# Altium schematic sheet nguyenly_so.SchDoc
size A3; SheetNumber: 1; SheetTotal: 1
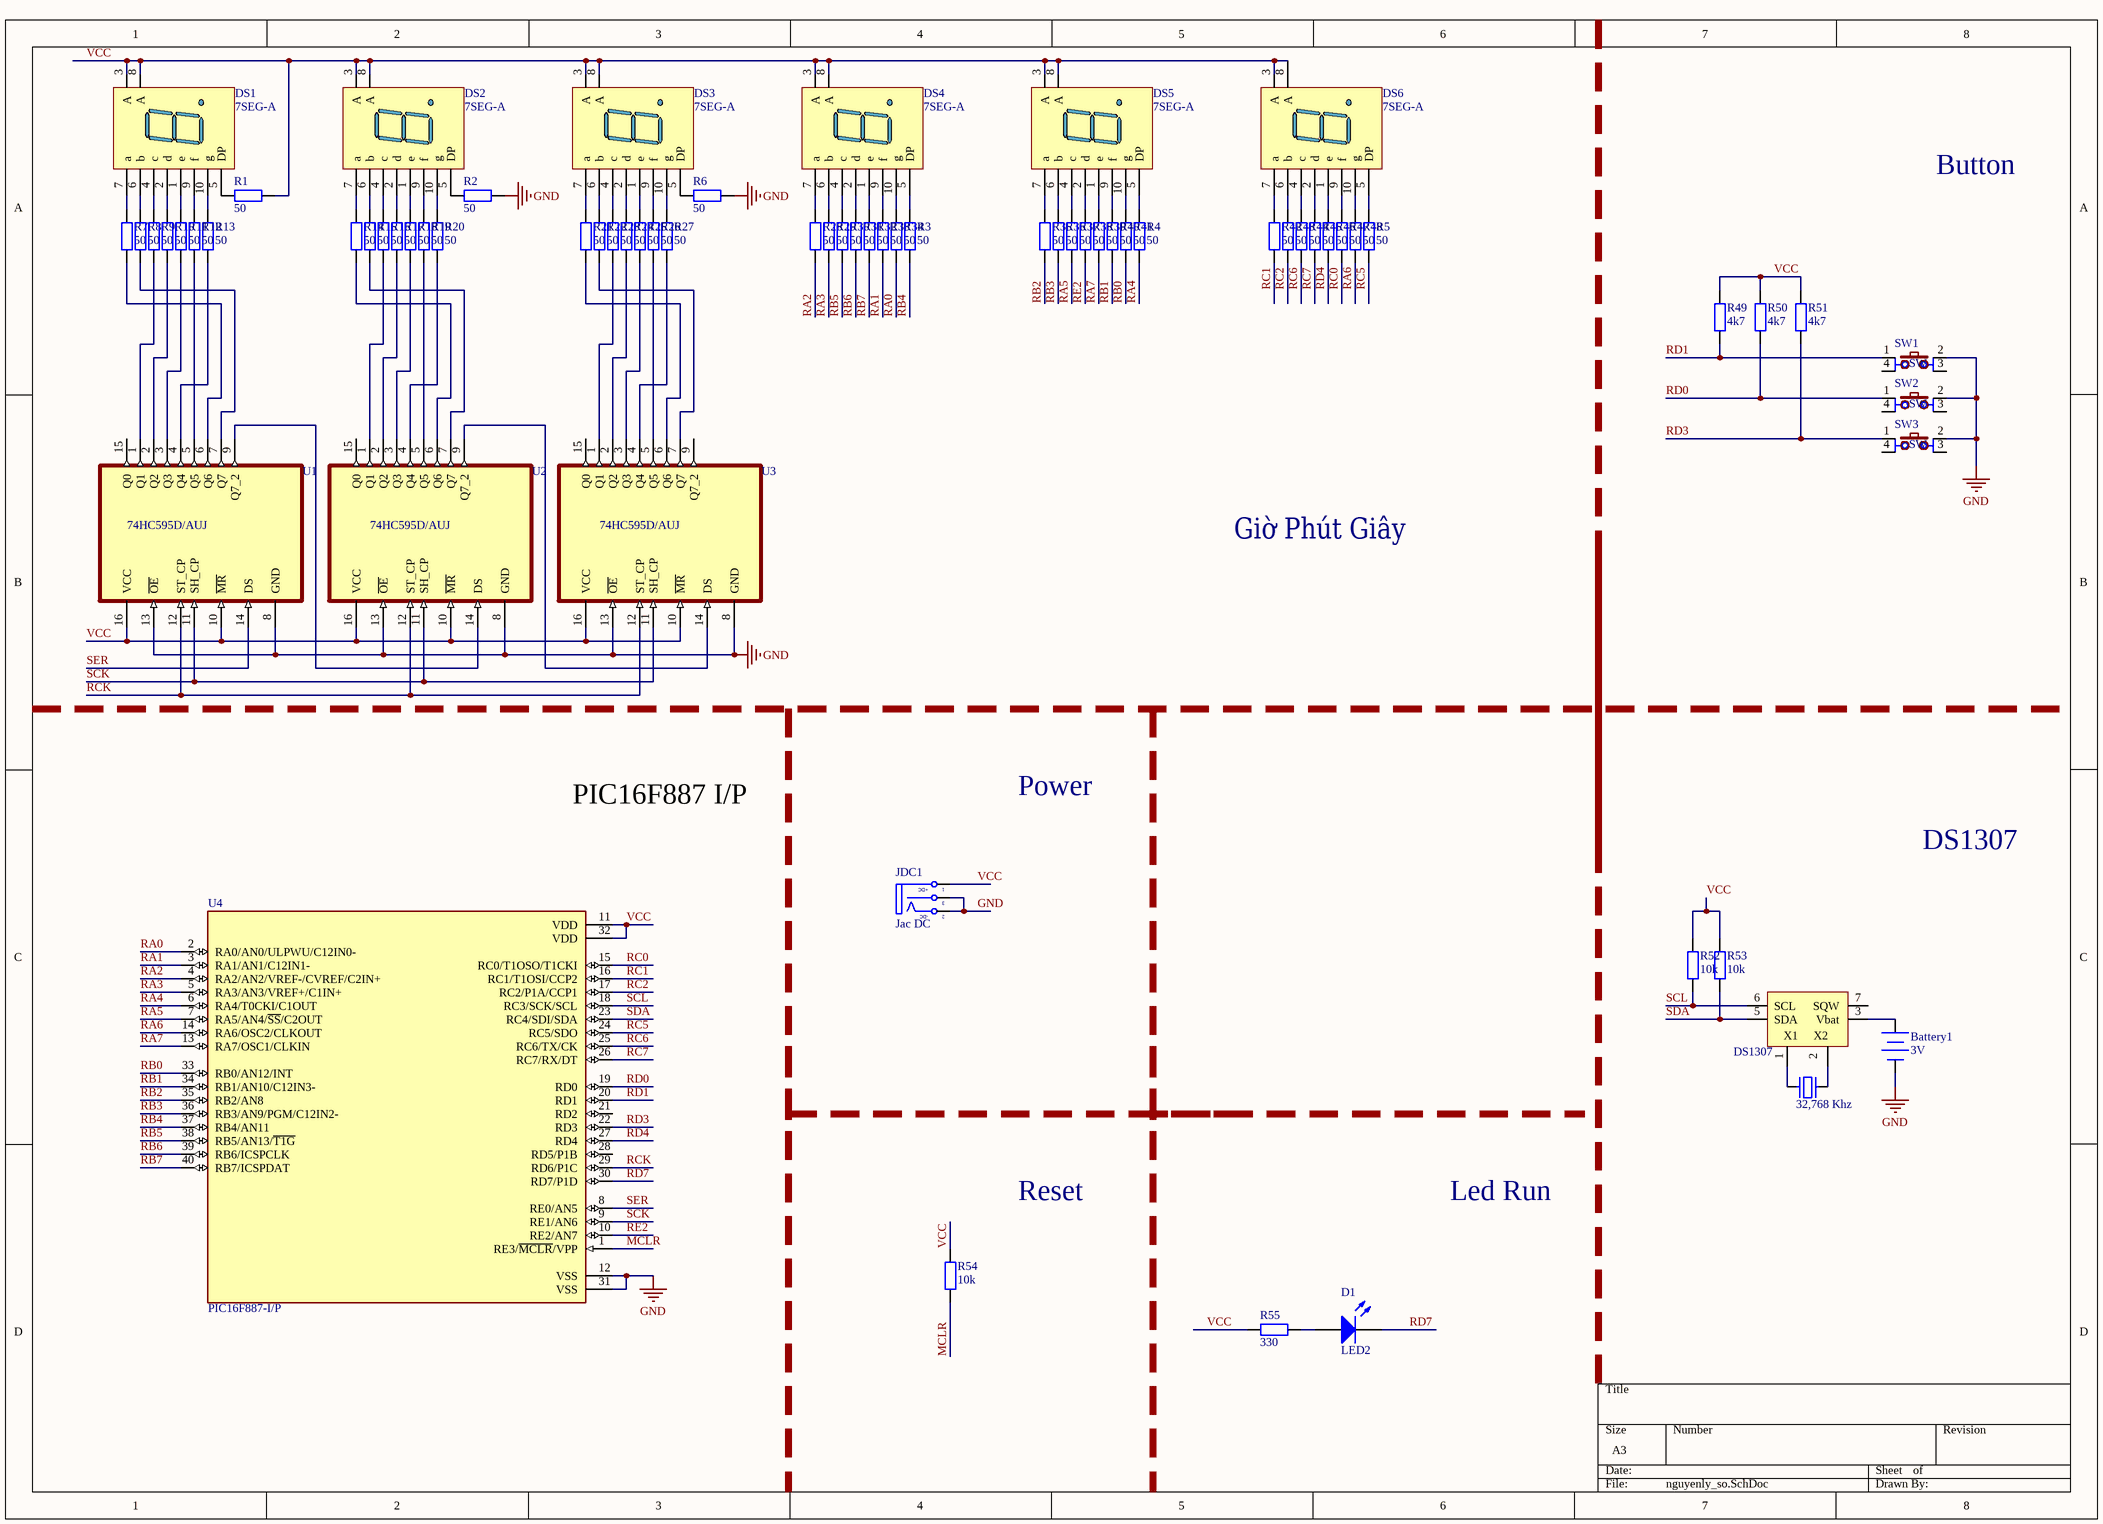
[diagram p0: nguyenly_so.SchDoc]

## Parts
Battery1  3V  [PIN_3v]
D1  LED2  [3.2X1.6X1.1]
DS1  7SEG-A  [led 7seg 3x4cm anot]
DS2  7SEG-A  [led 7seg 3x4cm anot]
DS3  7SEG-A  [led 7seg 3x4cm anot]
DS4  7SEG-A  [led 7seg 3x4cm anot]
DS5  7SEG-A  [led 7seg 3x4cm anot]
DS6  7SEG-A  [led 7seg 3x4cm anot]
IC1  DS1307  [DIP8/W0.3]
JDC1  Jac DC  [DC-IN]
R1  50  [SM-RES-0805]
R2  50  [SM-RES-0805]
R3  50  [SM-RES-0805]
R4  50  [SM-RES-0805]
R5  50  [SM-RES-0805]
R6  50  [SM-RES-0805]
R7  50  [SM-RES-0805]
R8  50  [SM-RES-0805]
R9  50  [SM-RES-0805]
R10  50  [SM-RES-0805]
R11  50  [SM-RES-0805]
R12  50  [SM-RES-0805]
R13  50  [SM-RES-0805]
R14  50  [SM-RES-0805]
R15  50  [SM-RES-0805]
R16  50  [SM-RES-0805]
R17  50  [SM-RES-0805]
R18  50  [SM-RES-0805]
R19  50  [SM-RES-0805]
R20  50  [SM-RES-0805]
R21  50  [SM-RES-0805]
R22  50  [SM-RES-0805]
R23  50  [SM-RES-0805]
R24  50  [SM-RES-0805]
R25  50  [SM-RES-0805]
R26  50  [SM-RES-0805]
R27  50  [SM-RES-0805]
R28  50  [SM-RES-0805]
R29  50  [SM-RES-0805]
R30  50  [SM-RES-0805]
R31  50  [SM-RES-0805]
R32  50  [SM-RES-0805]
R33  50  [SM-RES-0805]
R34  50  [SM-RES-0805]
R35  50  [SM-RES-0805]
R36  50  [SM-RES-0805]
R37  50  [SM-RES-0805]
R38  50  [SM-RES-0805]
R39  50  [SM-RES-0805]
R40  50  [SM-RES-0805]
R41  50  [SM-RES-0805]
R42  50  [SM-RES-0805]
R43  50  [SM-RES-0805]
R44  50  [SM-RES-0805]
R45  50  [SM-RES-0805]
R46  50  [SM-RES-0805]
R47  50  [SM-RES-0805]
R48  50  [SM-RES-0805]
R49  4k7  [SM-RES-0805]
R50  4k7  [SM-RES-0805]
R51  4k7  [SM-RES-0805]
R52  10k  [SM-RES-0805]
R53  10k  [SM-RES-0805]
R54  10k  [SM-RES-0805]
R55  330  [SM-RES-0805]
SW1  SW  [SW2-DIP]
SW2  SW  [SW2-DIP]
SW3  SW  [SW2-DIP]
U1  74HC595D/AUJ  [SOIC127P600X175-16N]
U2  74HC595D/AUJ  [SOIC127P600X175-16N]
U3  74HC595D/AUJ  [SOIC127P600X175-16N]
U4  PIC16F887-I/P  [DIP1543W47P254L5175H635Q40]
X1  32,768 Khz  [XT32k]

## Nets
GND: Battery1.2(-) IC1.4(GND) JDC1.2(TN) JDC1.3(S) R2.1 R6.2 SW1.2 SW2.2 SW3.2 U1.8(GND) U1.13(~{OE}) U2.8(GND) U2.13(~{OE}) U3.8(GND) U3.13(~{OE}) U4.12(VSS) U4.31(VSS)
VCC: DS1.3(A) DS1.8(A) DS2.3(A) DS2.8(A) DS3.3(A) DS3.8(A) DS4.3(A) DS4.8(A) DS5.3(A) DS5.8(A) DS6.3(A) DS6.8(A) IC1.8(VCC) JDC1.1(T) R1.1 R49.1 R50.1 R51.1 R52.1 R53.1 R54.1 R55.1 U1.10(~{MR}) U1.16(VCC) U2.10(~{MR}) U2.16(VCC) U3.10(~{MR}) U3.16(VCC) U4.11(VDD) U4.32(VDD)
MCLR: R54.2 U4.1(RE3/~{MCLR}/VPP)
RA0: R34.1 U4.2(RA0/AN0/ULPWU/C12IN0-)
RA1: R33.1 U4.3(RA1/AN1/C12IN1-)
RA2: R28.1 U4.4(RA2/AN2/VREF-/CVREF/C2IN+)
RA3: R29.1 U4.5(RA3/AN3/VREF+/C1IN+)
RA4: R4.1 U4.6(RA4/T0CKI/C1OUT)
RA5: R37.1 U4.7(RA5/AN4/~{SS}/C2OUT)
RA6: R48.1 U4.14(RA6/OSC2/CLKOUT)
RA7: R39.1 U4.13(RA7/OSC1/CLKIN)
RB0: R41.1 U4.33(RB0/AN12/INT)
RB1: R40.1 U4.34(RB1/AN10/C12IN3-)
RB2: R35.1 U4.35(RB2/AN8)
RB3: R36.1 U4.36(RB3/AN9/PGM/C12IN2-)
RB4: R3.1 U4.37(RB4/AN11)
RB5: R30.1 U4.38(RB5/AN13/~{T1G})
RB6: R31.1 U4.39(RB6/ICSPCLK)
RB7: R32.1 U4.40(RB7/ICSPDAT)
RC0: R47.1 U4.15(RC0/T1OSO/T1CKI)
RC1: R42.1 U4.16(RC1/T1OSI/CCP2)
RC2: R43.1 U4.17(RC2/P1A/CCP1)
RC5: R5.1 U4.24(RC5/SDO)
RC6: R44.1 U4.25(RC6/TX/CK)
RC7: R45.1 U4.26(RC7/RX/DT)
RCK: U1.12(ST_CP) U2.12(ST_CP) U3.12(ST_CP) U4.29(RD6/P1C)
RD0: R50.2 SW2.1 U4.19(RD0)
RD1: R49.2 SW1.1 U4.20(RD1)
RD3: R51.2 SW3.1 U4.22(RD3)
RD4: R46.1 U4.27(RD4)
RD7: D1.2(K) U4.30(RD7/P1D)
RE2: R38.1 U4.10(RE2/AN7)
SCK: U1.11(SH_CP) U2.11(SH_CP) U3.11(SH_CP) U4.9(RE1/AN6)
SCL: IC1.6(SCL) R52.2 U4.18(RC3/SCK/SCL)
SDA: IC1.5(SDA) R53.2 U4.23(RC4/SDI/SDA)
SER: U1.14(DS) U4.8(RE0/AN5)
NetBattery1_1: Battery1.1(+) IC1.3(Vbat)
NetD1_1: D1.1(A) R55.2
NetDS1_1: DS1.1(e) R11.2
NetDS1_2: DS1.2(d) R10.2
NetDS1_4: DS1.4(c) R9.2
NetDS1_5: DS1.5(DP) R1.2
NetDS1_6: DS1.6(b) R8.2
NetDS1_7: DS1.7(a) R7.2
NetDS1_9: DS1.9(f) R12.2
NetDS1_10: DS1.10(g) R13.2
NetDS2_1: DS2.1(e) R18.2
NetDS2_2: DS2.2(d) R17.2
NetDS2_4: DS2.4(c) R16.2
NetDS2_5: DS2.5(DP) R2.2
NetDS2_6: DS2.6(b) R15.2
NetDS2_7: DS2.7(a) R14.2
NetDS2_9: DS2.9(f) R19.2
NetDS2_10: DS2.10(g) R20.2
NetDS3_1: DS3.1(e) R25.2
NetDS3_2: DS3.2(d) R24.2
NetDS3_4: DS3.4(c) R23.2
NetDS3_5: DS3.5(DP) R6.1
NetDS3_6: DS3.6(b) R22.2
NetDS3_7: DS3.7(a) R21.2
NetDS3_9: DS3.9(f) R26.2
NetDS3_10: DS3.10(g) R27.2
NetDS4_1: DS4.1(e) R32.2
NetDS4_2: DS4.2(d) R31.2
NetDS4_4: DS4.4(c) R30.2
NetDS4_5: DS4.5(DP) R3.2
NetDS4_6: DS4.6(b) R29.2
NetDS4_7: DS4.7(a) R28.2
NetDS4_9: DS4.9(f) R33.2
NetDS4_10: DS4.10(g) R34.2
NetDS5_1: DS5.1(e) R39.2
NetDS5_2: DS5.2(d) R38.2
NetDS5_4: DS5.4(c) R37.2
NetDS5_5: DS5.5(DP) R4.2
NetDS5_6: DS5.6(b) R36.2
NetDS5_7: DS5.7(a) R35.2
NetDS5_9: DS5.9(f) R40.2
NetDS5_10: DS5.10(g) R41.2
NetDS6_1: DS6.1(e) R46.2
NetDS6_2: DS6.2(d) R45.2
NetDS6_4: DS6.4(c) R44.2
NetDS6_5: DS6.5(DP) R5.2
NetDS6_6: DS6.6(b) R43.2
NetDS6_7: DS6.7(a) R42.2
NetDS6_9: DS6.9(f) R47.2
NetDS6_10: DS6.10(g) R48.2
NetIC1_1: IC1.1(X1) X1.1
NetIC1_2: IC1.2(X2) X1.2
NetR7_1: R7.1 U1.6(Q6)
NetR8_1: R8.1 U1.7(Q7)
NetR9_1: R9.1 U1.1(Q1)
NetR10_1: R10.1 U1.2(Q2)
NetR11_1: R11.1 U1.3(Q3)
NetR12_1: R12.1 U1.5(Q5)
NetR13_1: R13.1 U1.4(Q4)
NetR14_1: R14.1 U2.6(Q6)
NetR15_1: R15.1 U2.7(Q7)
NetR16_1: R16.1 U2.1(Q1)
NetR17_1: R17.1 U2.2(Q2)
NetR18_1: R18.1 U2.3(Q3)
NetR19_1: R19.1 U2.5(Q5)
NetR20_1: R20.1 U2.4(Q4)
NetR21_1: R21.1 U3.6(Q6)
NetR22_1: R22.1 U3.7(Q7)
NetR23_1: R23.1 U3.1(Q1)
NetR24_1: R24.1 U3.2(Q2)
NetR25_1: R25.1 U3.3(Q3)
NetR26_1: R26.1 U3.5(Q5)
NetR27_1: R27.1 U3.4(Q4)
NetU1_9: U1.9(Q7_2) U2.14(DS)
NetU2_9: U2.9(Q7_2) U3.14(DS)

Not connected (* = marked no-connect by the designer): IC1 7(SQW); SW1 3 4; SW2 3 4; SW3 3 4; U1 15(Q0); U2 15(Q0); U3 9(Q7_2) 15(Q0); U4 21(RD2) 28(RD5/P1B)

## Notes on the sheet
- Button
- Giờ Phút Giây
- Power
- PIC16F887 I/P
- DS1307
- Reset
- Led Run
- (in symbol DCIN) +DC; -DC

## Library data of the parts
Battery1 = Battery: Multicell Battery; Published: 24-Mar-1999; LatestRevisionDate: 17-Jul-2002; LatestRevisionNote: Re-released for DXP Platform.; PackageReference: BAT-2; Publisher: Altium Limited
D1 = LED2: Typical RED, GREEN, YELLOW, AMBER GaAs LED; Published: 8-Jun-2000; LatestRevisionDate: 17-Jul-2002; LatestRevisionNote: Re-released for DXP Platform.; PackageVersion: Feb-2002; PackageReference: 3.2X1.6X1.1; Publisher: Altium Limited; PackageDescription: SM LED; 2 Flat Leads
DS1-DS6 = LED 7SEG-A: 14.2 mm General Purpose Blue 7-Segment Display: CA, RH DP, Gray Surface; MinimumIntensity: 2020 ucd; Note: IF = 10 mA; Published: 8-Jun-2000; LatestRevisionDate: 17-Dec-2003; LatestRevisionNote: Schematic revised, PCB Footprint replaced.; DatasheetDocument: 24-Sep-2002; PackageDocument: 24-Sep-2002; PackageReference: H; Publisher: Altium Limited; Colour: Blue; ComponentLink1Description: Manufacturer Link; ComponentLink1URL: http://www.agilent.com/
IC1 = DS1307: Real Timer Serial; Value: DS1307
JDC1 = DCIN: Jac DC input; Value: Jac DC
R1-R55 = R1/4W: Resistor 1/4W; Value: R1/4W - 1K
SW1-SW3 = SW4: Switch button 4 pin; Value: Button chip 4 pin
U1-U3 = 74HC595D/AUJ: Ic Counter Register 8bit 16soic; MF: NXP USA; Price: None; MP: 74HC595D/AUJ; Package: SOIC-16 NXP Semiconductors; Value: *; Availability: Unavailable; SnapEDA_Link: https://www.snapeda.com/parts/74HC595D/AUJ/NXP%20USA%20Inc./view-part/1041585/?ref=snap
U4 = PIC16F887-I/P: MCU, 8-Bit, 14KB Flash, 368 RAM, 36 I/O, PDIP-40, PIC 16F Series | Microchip Technology Inc. PIC16F887-I/P; SnapEDA_Link: https://www.snapeda.com/parts/PIC16F887-I/P/Microchip/view-part/?ref=snap; Package: PDIP-40 Microchip; Value: *; MF: Microchip; MP: PIC16F887-I/P; Check_prices: https://www.snapeda.com/parts/PIC16F887-I/P/Microchip/view-part/?ref=eda
X1 = XT32k: Crystal 32,768kHz for timer real; Value: 32,768khz